# Altium project PROC054D_MMW_CAS_RF_EVM.PrjPcb (part 2 of 9)

## Sheet PROC054D_40MHZ_Clock.SchDoc: 40MHZ_CLOCK_1
size 558 x 431 mm; Date: Not shown in title block; ApprovedBy: Not shown in title block; CheckedBy: Not shown in title block; Author: Not shown in title block; CompanyName: Not shown in title block; DrawnBy: a0271760; Engineer: Not shown in title block; Organization: Not shown in title block; Address1: Not shown in title block; Address2: Not shown in title block; Address3: Not shown in title block; Address4: Not shown in title block; DocumentNumber: 13; Revision: Use project pAWRameter SCH_Rev; SheetNumber: 13; SheetTotal: 19; PageSetup: Record=PageOptions|CenterHorizontal=True|CenterVertical=True|PrintScale=1.00|XCorrection=1.00|YCorrection=1.00|PrintKind=0|BorderSize=5000000|LeftOffset=0|BottomOffset=0|Orientation=2|PaperLength=1000|PaperWidth=1000|Scale=100|PaperSource=15|PrintQuality=600|MediaType=1|DitherType=10|PaperKind=Letter|PrintScaleMode=1; CurrentTime: Not shown in title block; CurrentDate: Not shown in title block; Time: Not shown in title block; DocumentFullPathAndName: Not shown in title block; DocumentName: Not shown in title block; ModifiedDate: Not shown in title block; ImagePath: Not shown in title block
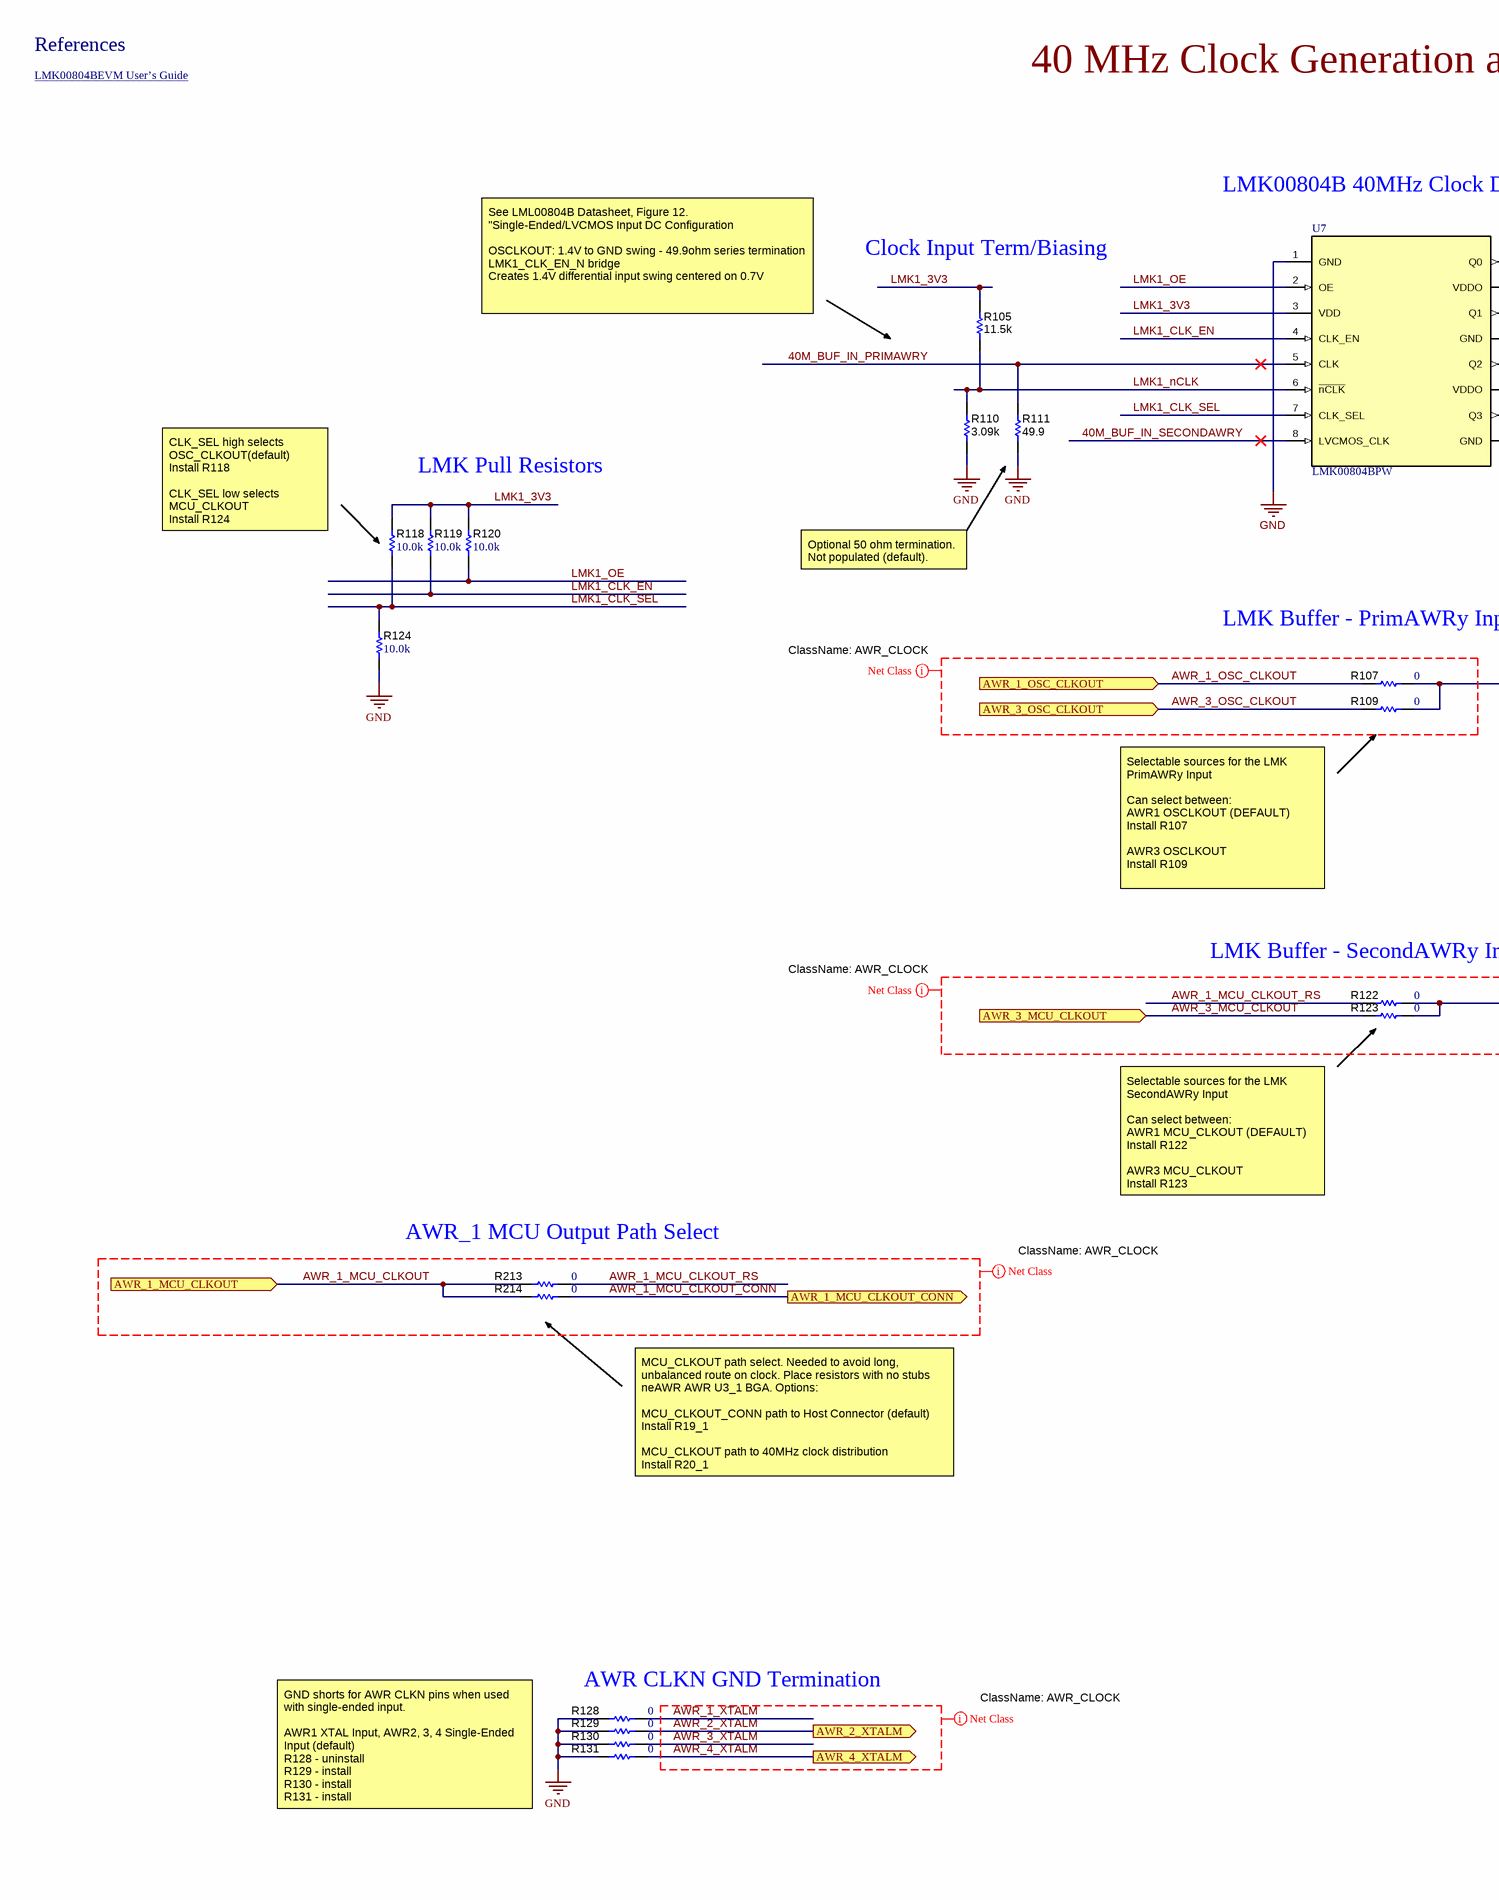
[diagram p8: PROC054D_40MHZ_Clock.SchDoc, left]
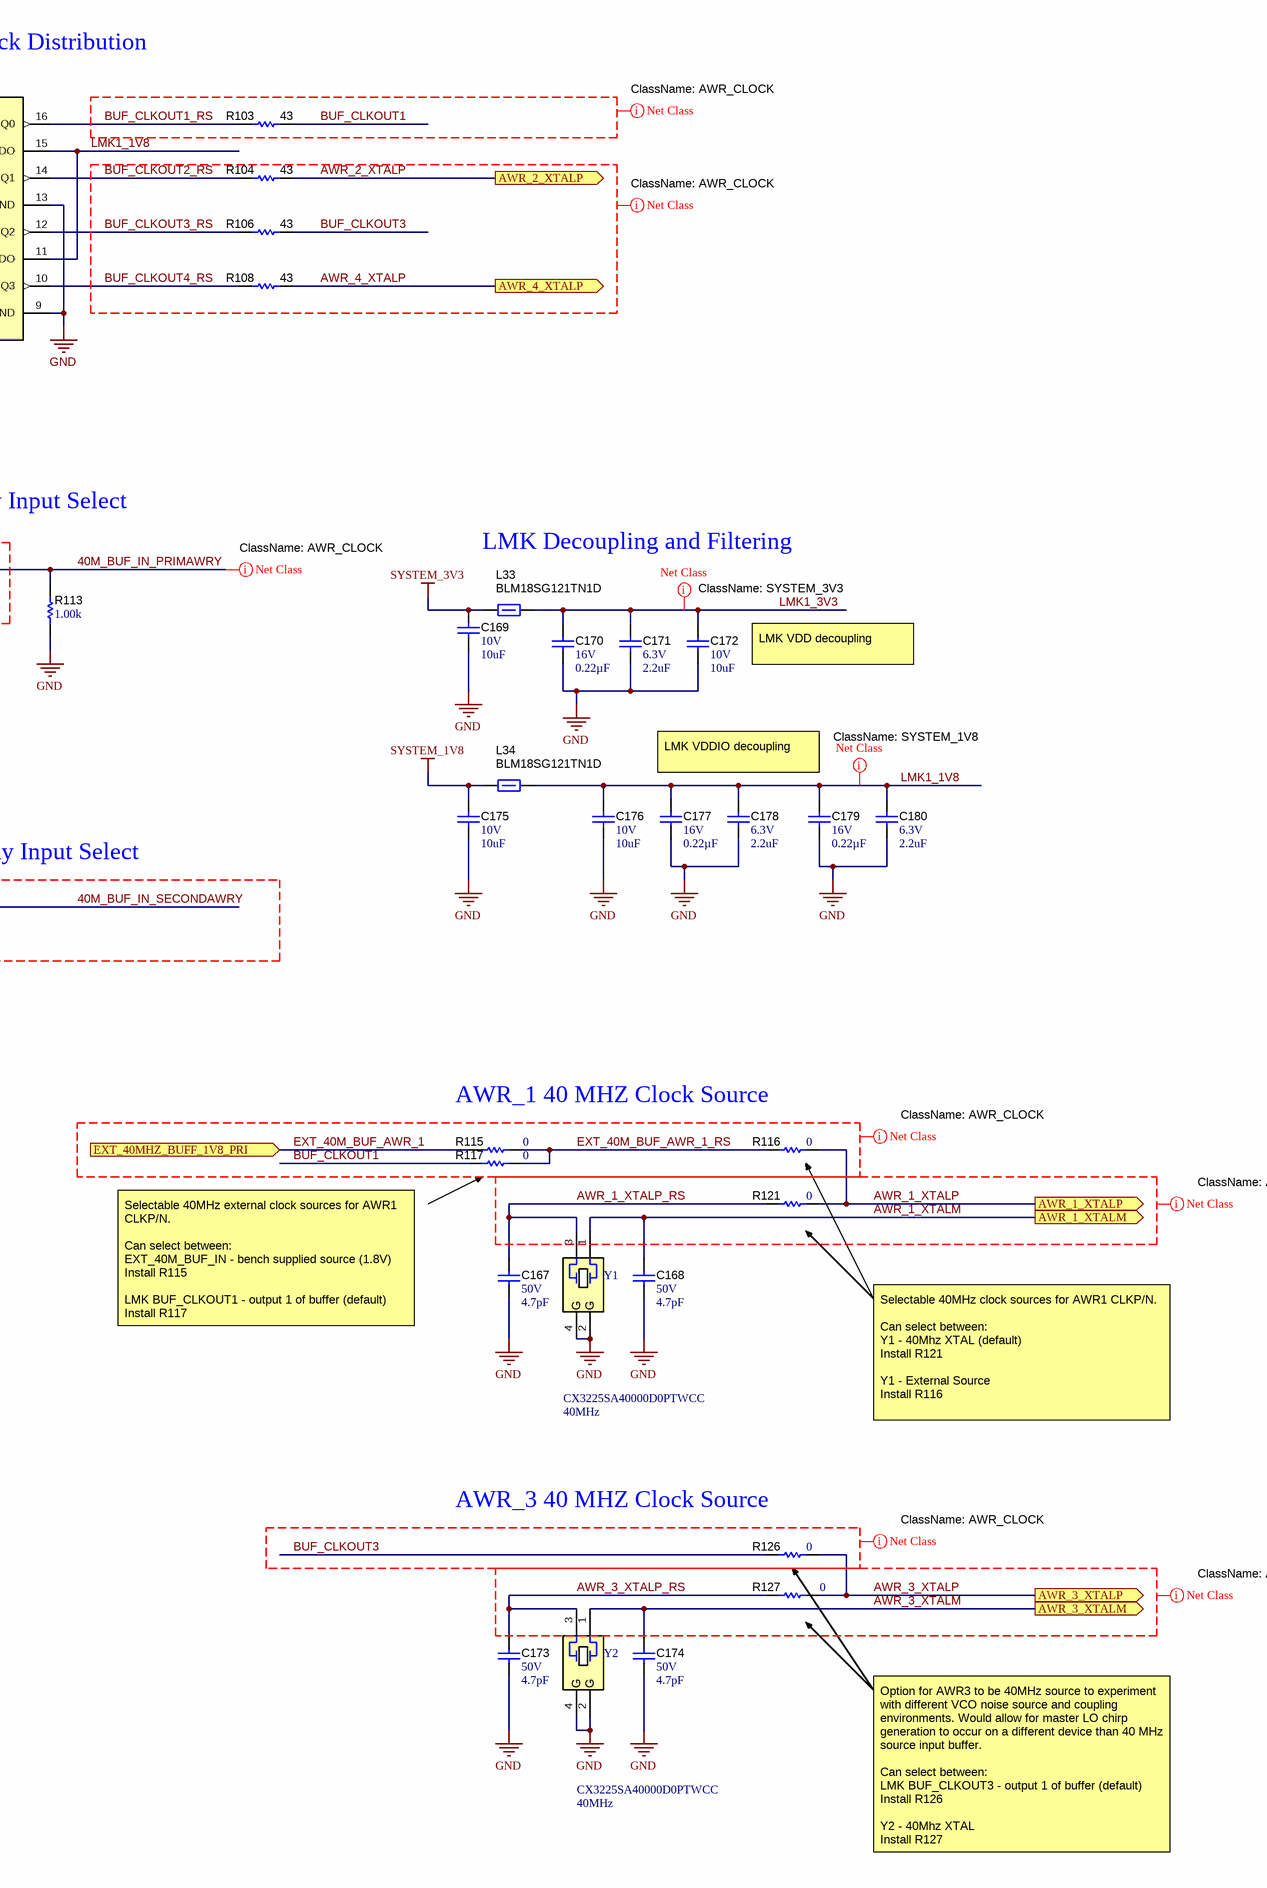
[diagram p9: PROC054D_40MHZ_Clock.SchDoc, right]

### Parts
C167  VDC_V: 50V  ValueDisplayed: 4.7pF  [0402]  (hidden comment: GJM1555C1H4R7BB01D)
C168  VDC_V: 50V  ValueDisplayed: 4.7pF  [0402]  (hidden comment: GJM1555C1H4R7BB01D)
C169  VDC_V: 10V  ValueDisplayed: 10uF  [0805_HV]  (hidden comment: GCM21BR71A106KE22L)
C170  VDC_V: 16V  ValueDisplayed: 0.22µF  [0402]  (hidden comment: GCM155R71C224KE02D)
C171  VDC_V: 6.3V  ValueDisplayed: 2.2uF  [0603]  (hidden comment: GCM188R70J225KE22D)
C172  VDC_V: 10V  ValueDisplayed: 10uF  [0805_HV]  (hidden comment: GCM21BR71A106KE22L)
C173  VDC_V: 50V  ValueDisplayed: 4.7pF  [0402]  (hidden comment: GJM1555C1H4R7BB01D)
C174  VDC_V: 50V  ValueDisplayed: 4.7pF  [0402]  (hidden comment: GJM1555C1H4R7BB01D)
C175  VDC_V: 10V  ValueDisplayed: 10uF  [0805_HV]  (hidden comment: GCM21BR71A106KE22L)
C176  VDC_V: 10V  ValueDisplayed: 10uF  [0805_HV]  (hidden comment: GCM21BR71A106KE22L)
C177  VDC_V: 16V  ValueDisplayed: 0.22µF  [0402]  (hidden comment: GCM155R71C224KE02D)
C178  VDC_V: 6.3V  ValueDisplayed: 2.2uF  [0603]  (hidden comment: GCM188R70J225KE22D)
C179  VDC_V: 16V  ValueDisplayed: 0.22µF  [0402]  (hidden comment: GCM155R71C224KE02D)
C180  VDC_V: 6.3V  ValueDisplayed: 2.2uF  [0603]  (hidden comment: GCM188R70J225KE22D)
L33  BLM18SG121TN1D  [0603]
L34  BLM18SG121TN1D  [0603]
R103  ValueDisplayed: 43  [0402]  (hidden comment: CRCW040243R0JNED)
R104  ValueDisplayed: 43  [0402]  (hidden comment: CRCW040243R0JNED)
R105  ValueDisplayed: 11.5k  [0402]  (hidden comment: ERJ-2RKF1152X)
R106  ValueDisplayed: 43  [0402]  (hidden comment: CRCW040243R0JNED)
R107  ValueDisplayed: 0  [0402]  (hidden comment: ERJ-2GE0R00X)
R108  ValueDisplayed: 43  [0402]  (hidden comment: CRCW040243R0JNED)
R109  ValueDisplayed: 0  [0402]  (hidden comment: ERJ-2GE0R00X)
R110  ValueDisplayed: 3.09k  [0402]  (hidden comment: ERJ-2RKF3091X)
R111  ValueDisplayed: 49.9  [0402]  (hidden comment: ERJ-2RKF49R9X)
R113  ValueDisplayed: 1.00k  [0402]  (hidden comment: CRCW04021K00FKED)
R115  ValueDisplayed: 0  [0402]  (hidden comment: ERJ-2GE0R00X)
R116  ValueDisplayed: 0  [0402]  (hidden comment: ERJ-2GE0R00X)
R117  ValueDisplayed: 0  [0402]  (hidden comment: ERJ-2GE0R00X)
R118  ValueDisplayed: 10.0k  [0402]  (hidden comment: CRCW040210K0FKED)
R119  ValueDisplayed: 10.0k  [0402]  (hidden comment: CRCW040210K0FKED)
R120  ValueDisplayed: 10.0k  [0402]  (hidden comment: CRCW040210K0FKED)
R121  ValueDisplayed: 0  [0402]  (hidden comment: ERJ-2GE0R00X)
R122  ValueDisplayed: 0  [0402]  (hidden comment: ERJ-2GE0R00X)
R123  ValueDisplayed: 0  [0402]  (hidden comment: ERJ-2GE0R00X)
R124  ValueDisplayed: 10.0k  [0402]  (hidden comment: CRCW040210K0FKED)
R126  ValueDisplayed: 0  [0402]  (hidden comment: ERJ-2GE0R00X)
R127  ValueDisplayed: 0  [0201]  (hidden comment: CRCW02010000Z0ED)
R128  ValueDisplayed: 0  [0402]  (hidden comment: ERJ-2GE0R00X)
R129  ValueDisplayed: 0  [0402]  (hidden comment: ERJ-2GE0R00X)
R130  ValueDisplayed: 0  [0402]  (hidden comment: ERJ-2GE0R00X)
R131  ValueDisplayed: 0  [0402]  (hidden comment: ERJ-2GE0R00X)
R213  ValueDisplayed: 0  [0402S]  (hidden comment: ERJ-2GE0R00X)
R214  ValueDisplayed: 0  [0402S]  (hidden comment: ERJ-2GE0R00X)
U7  LMK00804BPW  [PW0016A_N]
Y1  Frequency_Fixed: 40MHz  [Kyocera_CX3225SA]  (hidden comment: CX3225SA40000D0PTWCC)
Y2  Frequency_Fixed: 40MHz  [Kyocera_CX3225SA]  (hidden comment: CX3225SA40000D0PTWCC)

### Ports
AWR_1_MCU_CLKOUT (in), AWR_1_MCU_CLKOUT_CONN (out), AWR_1_OSC_CLKOUT (in), AWR_1_XTALM (out), AWR_1_XTALP (out), AWR_2_XTALM (out), AWR_2_XTALP (out), AWR_3_MCU_CLKOUT (in), AWR_3_OSC_CLKOUT (in), AWR_3_XTALM (out), AWR_3_XTALP (out), AWR_4_XTALM (out), AWR_4_XTALP (out), EXT_40MHZ_BUFF_1V8_PRI (in)

### Nets
GND: C167.2 C168.1 C169.2 C170.2 C171.1 C172.2 C173.2 C174.2 C175.2 C176.2 C177.2 C178.1 C179.2 C180.1 R110.1 R111.1 R113.1 R124.1 R128.2 R129.1 R130.1 R131.1 U7.1(GND) U7.9(GND) U7.13(GND) Y1.2(GND) Y1.4(GND) Y2.2(GND) Y2.4(GND)
SYSTEM_1V8: C175.1 L34.1
SYSTEM_3V3: C169.1 L33.1
40M_BUF_IN_PRIMAWRY: R107.2 R109.2 R111.2 R113.2 U7.5(CLK)
40M_BUF_IN_SECONDAWRY: R122.2 R123.2 U7.8(LVCMOS_CLK)
AWR_1_MCU_CLKOUT: R213.1 R214.1 ; port AWR_1_MCU_CLKOUT
AWR_1_MCU_CLKOUT_CONN: R214.2 ; port AWR_1_MCU_CLKOUT_CONN
AWR_1_MCU_CLKOUT_RS: R122.1 R213.2
AWR_1_OSC_CLKOUT: R107.1 ; port AWR_1_OSC_CLKOUT
AWR_1_XTALM: C168.2 R128.1 Y1.1 ; port AWR_1_XTALM
AWR_1_XTALP: R116.2 R121.2 ; port AWR_1_XTALP
AWR_1_XTALP_RS: C167.1 R121.1 Y1.3
AWR_2_XTALM: R129.2 ; port AWR_2_XTALM
AWR_2_XTALP: R104.2 ; port AWR_2_XTALP
AWR_3_MCU_CLKOUT: R123.1 ; port AWR_3_MCU_CLKOUT
AWR_3_OSC_CLKOUT: R109.1 ; port AWR_3_OSC_CLKOUT
AWR_3_XTALM: C174.1 R130.2 Y2.1 ; port AWR_3_XTALM
AWR_3_XTALP: R126.2 R127.2 ; port AWR_3_XTALP
AWR_3_XTALP_RS: C173.1 R127.1 Y2.3
AWR_4_XTALM: R131.2 ; port AWR_4_XTALM
AWR_4_XTALP: R108.2 ; port AWR_4_XTALP
BUF_CLKOUT1: R103.2 R117.1
BUF_CLKOUT1_RS: R103.1 U7.16(Q0)
BUF_CLKOUT2_RS: R104.1 U7.14(Q1)
BUF_CLKOUT3: R106.2 R126.1
BUF_CLKOUT3_RS: R106.1 U7.12(Q2)
BUF_CLKOUT4_RS: R108.1 U7.10(Q3)
EXT_40M_BUF_AWR_1: R115.1 ; port EXT_40MHZ_BUFF_1V8_PRI
EXT_40M_BUF_AWR_1_RS: R115.2 R116.1 R117.2
LMK1_1V8: C176.1 C177.1 C178.2 C179.1 C180.2 L34.2 U7.11(VDDO) U7.15(VDDO)
LMK1_3V3: C170.1 C171.2 C172.1 L33.2 R105.2 R118.2 R119.2 R120.2 U7.3(VDD)
LMK1_CLK_EN: R119.1 U7.4(CLK_EN)
LMK1_CLK_SEL: R118.1 R124.2 U7.7(CLK_SEL)
LMK1_nCLK: R105.1 R110.2 U7.6(~{nCLK})
LMK1_OE: R120.1 U7.2(OE)

### Layout directives
net class SYSTEM_3V3: LMK1_3V3
net class SYSTEM_1V8: LMK1_1V8
net class AWR_CLOCK: 40M_BUF_IN_PRIMAWRY, 40M_BUF_IN_SECONDAWRY, AWR_1_MCU_CLKOUT, AWR_1_MCU_CLKOUT_CONN, AWR_1_MCU_CLKOUT_RS, AWR_1_OSC_CLKOUT, AWR_1_XTALM, AWR_1_XTALP, AWR_1_XTALP_RS, AWR_2_XTALM, AWR_2_XTALP, AWR_3_MCU_CLKOUT, AWR_3_OSC_CLKOUT, AWR_3_XTALM, AWR_3_XTALP, AWR_3_XTALP_RS, AWR_4_XTALM, AWR_4_XTALP, BUF_CLKOUT1, BUF_CLKOUT1_RS, BUF_CLKOUT2_RS, BUF_CLKOUT3, BUF_CLKOUT3_RS, BUF_CLKOUT4_RS, EXT_40M_BUF_AWR_1, EXT_40M_BUF_AWR_1_RS

### Notes on the sheet
- References
- LMK00804BEVM User’s Guide <http://www.ti.com/lit/ug/snou129/snou129.pdf>
- 40 MHz Clock Generation and Distribution
- LMK00804B 40MHz Clock Distribution
- Clock Input Term/Biasing
- See LML00804B Datasheet, Figure 12. "Single-Ended/LVCMOS Input DC Configuration
  OSCLKOUT: 1.4V to GND swing - 49.9ohm series termination
  LMK1_CLK_EN_N bridge
  Creates 1.4V differential input swing centered on 0.7V
- LMK Pull Resistors
- CLK_SEL high selects
  OSC_CLKOUT(default)
  Install R118
  CLK_SEL low selects
  MCU_CLKOUT
  Install R124
- Optional 50 ohm termination.
  Not populated (default).
- LMK Buffer - PrimAWRy Input Select
- LMK Decoupling and Filtering
- LMK VDD decoupling
- Selectable sources for the LMK PrimAWRy Input
  Can select between:
  AWR1 OSCLKOUT (DEFAULT)
  Install R107
  AWR3 OSCLKOUT
  Install R109
- LMK VDDIO decoupling
- LMK Buffer - SecondAWRy Input Select
- Selectable sources for the LMK SecondAWRy Input
  Can select between:
  AWR1 MCU_CLKOUT (DEFAULT)
  Install R122
  AWR3 MCU_CLKOUT
  Install R123
- AWR_1 40 MHZ Clock Source
- AWR_1 MCU Output Path Select
- Selectable 40MHz external clock sources for AWR1 CLKP/N.
  Can select between:
  EXT_40M_BUF_IN - bench supplied source (1.8V)
  Install R115
  LMK BUF_CLKOUT1 - output 1 of buffer (default)
  Install R117
- MCU_CLKOUT path select. Needed to avoid long, unbalanced route on clock. Place resistors with no stubs neAWR AWR U3_1 BGA. Options:
  MCU_CLKOUT_CONN path to Host Connector (default)
  Install R19_1
  MCU_CLKOUT path to 40MHz clock distribution
  Install R20_1
- Selectable 40MHz clock sources for AWR1 CLKP/N.
  Can select between:
  Y1 - 40Mhz XTAL (default)
  Install R121
  Y1 - External Source
  Install R116
- (near R126) AWR_3 40 MHZ Clock Source
- AWR CLKN GND Termination
- GND shorts for AWR CLKN pins when used with single-ended input.
  AWR1 XTAL Input, AWR2, 3, 4 Single-Ended Input (default)
  R128 - uninstall
  R129 - install
  R130 - install
  R131 - install
- Option for AWR3 to be 40MHz source to experiment with different VCO noise source and coupling environments. Would allow for master LO chirp generation to occur on a different device than 40 MHz source input buffer.
  Can select between:
  LMK BUF_CLKOUT3 - output 1 of buffer (default)
  Install R126
  Y2 - 40Mhz XTAL
  Install R127
- Drawn By:
- SVN Rev:
- Number:
- TID #:
- Orderable:
- Rev:
- Sheet Title:
- File:
- Project Title:
- Designed for:
- Assembly VAWRiant:
- Mod. Date:
- Sheet:
- Size:
- of
- C
- http://www.ti.com
- Texas Instruments and/or its licensors do not wAWRrant the accuracy or completeness of this specification or any information contained therein. Texas Instruments and/or its licensors do not wAWRrant that this design will meet the specifications, will be suitable for your application or fit for any pAWRticulAWR purpose, or will operate in an implementation. Texas Instruments and/or its licensors do not wAWRrant that the design is production worthy. You should completely validate and test your design implementation to confirm the system functionality for your application.
- Engineer:
- Contact:
- © Texas Instruments
- (in symbol CMP-0004694-3) G

### Library data of the parts
C167 C168 C173 C174 = CMP-0006367-2: CAP, CERM, 4.7 pF, 50 V, +/- 2%, C0G/NP0, 0402; Manufacturer: MuRata; TaMin_C: -55°C; Polarized: N; SizeAreaWB_mm2: 3; Value1: Unknown; U/M: EA; Value: 4.7pF; TaMax_C: 125°C; SizeZ_mm: 0.6; SizeX_mm: 1; SizeY_mm: 0.5; AEC Category: Q200; Supplier Part Number 2: 81-GJM1555C1H4R7BB01; Publisher: Texas Instruments; Supplier 2: Mouser; TempCo: C0G/NP0; Published: 2008-06-19; RoHS: Y; MountType: SMT; Supplier 1: Digi-Key; PackageReference: 0402; Tolerance_%: 2%; Cap_Case: 0402; Value2: 50V; SizeArea_mm2: 0.5; CompType: Capacitor; LatestRevisionDate: 2017-03-09; PartNumber: GJM1555C1H4R7BB01D; AEC Qualified: N; Cap_F: 4.7pF; ComponentLink1Description: Datasheet link; AEC Grade: N/A; Supplier Part Number 1: 490-8102-1-ND; Technology: Ceramic; ComponentLink1URL: http://psearch.murata.com/capacitor/product/GJM1555C1H4R7BB01%23.pdf
C169 C172 C175 C176 = CMP-0008017-2: CAP, CERM, 10 uF, 10 V, +/- 10%, X7R, 0805; Manufacturer: MuRata; TaMin_C: -55°C; Polarized: N; SizeAreaWB_mm2: 6.75; Value1: Unknown; U/M: EA; Value: 10uF; TaMax_C: 125°C; SizeZ_mm: 1.45; SizeX_mm: 2; SizeY_mm: 1.25; Cap_Case: 0805; SizeArea_mm2: 2.5; CompType: Capacitor; Cap_F: 10µF; AEC Category: Q200; Supplier Part Number 2: 06AC6014; Publisher: Texas Instruments; Supplier 2: Newark; Supplier Part Number 3: 81-GCM21BR71A106KE2L; TempCo: X7R; Supplier 3: Mouser; Published: 2008-06-19; RoHS: Y; MountType: SMT; Supplier 1: Digi-Key; PackageReference: 0805; Tolerance_%: 10%; Value2: 10V; LatestRevisionDate: 2017-03-09; PartNumber: GCM21BR71A106KE22L; AEC Qualified: ?; ComponentLink1Description: Datasheet link; Supplier Part Number 1: 490-10674-1-ND; Technology: Ceramic; ComponentLink1URL: http://www.murata.com/products/catalog/pdf/c03e.pdf
C170 C177 C179 = CMP-0078265-1: CAP, CERM, 0.22 µF, 16 V,+/- 10%, X7R, AEC-Q200 Grade 1, 0402; Manufacturer: MuRata; TaMin_C: -55°C; Polarized: N; SizeAreaWB_mm2: 3; U/M: EA; Value: 0.22uF; TaMax_C: 125°C; SizeZ_mm: 0.6; SizeX_mm: 1; SizeY_mm: 0.5; CompType: Capacitor; AEC Qualified: Y; Cap_F: 220nF; AEC Category: Q200; ComponentLink1URL: http://psearch.en.murata.com/capacitor/product/GCM155R71C224KE02%23.pdf; Supplier Part Number 2: 81-GCM155R71C224KE2D; Supplier 2: Mouser; TempCo: X7R; RoHS: Y; MountType: SMT; Supplier 1: Digi-Key; PackageReference: 0402; Tolerance_%: 10%; Cap_Case: 0402; Value2: 16V; SizeArea_mm2: 0.5; PartNumber: GCM155R71C224KE02D; ComponentLink1Description: Datasheet link; AEC Grade: 1; Supplier Part Number 1: 490-10671-1-ND; Technology: Ceramic
C171 C178 C180 = CMP-0007134-5: CAP, CERM, 2.2 uF, 6.3 V, +/- 10%, X7R, AEC-Q200 Grade 1, 0603; Manufacturer: MuRata; TaMin_C: -55°C; Polarized: N; SizeAreaWB_mm2: 4.68; Value1: Unknown; U/M: EA; Value: 2.2uF; TaMax_C: 125°C; SizeZ_mm: 1; SizeX_mm: 1.6; SizeY_mm: 0.8; SizeArea_mm2: 1.28; AEC Qualified: Y; Cap_F: 2.2µF; AEC Category: Q200; Supplier Part Number 2: 81-GCM188R70J225KE2D; Publisher: Texas Instruments; Supplier 2: Mouser; TempCo: X7R; Published: 2008-06-19; RoHS: Y; MountType: SMT; Supplier 1: Digi-Key; PackageReference: 0603; Tolerance_%: 10%; Cap_Case: 0603; Value2: 6.3V; CompType: Capacitor; LatestRevisionDate: 2017-03-09; PartNumber: GCM188R70J225KE22D; ComponentLink1Description: Datasheet link; AEC Grade: 1; Supplier Part Number 1: 490-5316-1-ND; Technology: Ceramic; ComponentLink1URL: http://psearch.en.murata.com/capacitor/product/GCM188R70J225KE22%23.pdf
L33 L34 = CMP-0003352-2: Ferrite Bead, 120 ohm @ 100 MHz, 3 A, 0603; Manufacturer: MuRata; ZTyp@100MHz_Ohm: 120; SizeAreaWB_mm2: 4.68; DCR_ohm: 0.025; Value1: 0.025 ohm; Value: 120 ohm; Imax_A: 3A; SizeZ_mm: 1; SizeX_mm: 1.6; SizeY_mm: 0.8; SizeArea_mm2: 1.28; ComponentLink1URL: http://search.murata.co.jp/Ceramy/image/img/PDF/ENG/L0110S0100BLM18S.pdf; Supplier Part Number 2: 73M9122; Publisher: Texas Instruments; Supplier 2: Newark; Supplier Part Number 3: 81-BLM18SG121TN1D; Supplier 3: Mouser; Published: 2014-04-30; RoHS: Y; MountType: SMT; Supplier 1: Digi-Key; PackageReference: 0603; Value2: 3A; CompType: Ferrite Bead; LatestRevisionDate: 2017-03-09; PartNumber: BLM18SG121TN1D; ComponentLink1Description: Datasheet link; Supplier Part Number 1: 490-3996-1-ND; ValueDisplayed: 120 ohm
R103 R104 R106 R108 = CMP-0026932-3: RES, 43, 5%, 0.063 W, AEC-Q200 Grade 0, 0402; Manufacturer: Vishay-Dale; Power_W: 63mW; TempCo: 200 ppm/C; Value_Code: 43R0; Value: 43; EIA_Code: E24; SizeX_mm: 1; SizeY_mm: 0.5; SizeZ_mm: 0.6; Value2: 0.063W; AEC Qualified: Y; VDC_V: 50V; AEC Category: Q200; AEC Grade: 0; Supplier Part Number 2: 71-CRCW0402J-43-E3; Supplier 2: Mouser; RoHS: E; Value1: 5%; MountType: SMT; Supplier 1: Digi-Key; PackageReference: 0402; Tolerance_%: 5%; Res_ohm: 43; SizeArea_mm2: 0.5; CompType: Resistor; PartNumber: CRCW040243R0JNED; ComponentLink1Description: Datasheet link; Supplier Part Number 1: 541-43JCT-ND; Technology: Thick Film; ComponentLink1URL: http://www.vishay.com/docs/20035/dcrcwe3.pdf
R105 = CMP-0082348-1: RES, 11.5 k, 1%, 0.1 W, AEC-Q200 Grade 0, 0402; Manufacturer: Panasonic; Value_Code: 11k5; SizeAreaWB_mm2: 3; SizeArea_mm2: 0.5; AEC Qualified: Y; AEC Category: Q200; Value: 11.5k; SizeZ_mm: 0.6; EIA_Code: E96; TempCo: 100 ppm/C; AEC Grade: 0; Power_W: 100mW; Value2: 0.1W; SizeX_mm: 1; ComponentLink1Description: Datasheet link; RoHS: Y; Tolerance_%: 1%; PackageReference: 0402; Technology: Thick Film; Res_ohm: 11.5k; PartNumber: ERJ-2RKF1152X; SizeY_mm: 0.5; ComponentLink1URL: https://industrial.panasonic.com/cdbs/www-data/pdf/RDA0000/AOA0000C304.pdf; Value1: 1%; CompType: Resistor; MountType: SMT
R107 R109 R117 R122 R123 R129-R131 R213 R214 = CMP-0026992-3: RES, 0, 5%, 0.1 W, AEC-Q200 Grade 0, 0402; Manufacturer: Panasonic; Power_W: 100mW; TempCo: 600 ppm/C; Value_Code: 0000; Value: 0; EIA_Code: E24; SizeX_mm: 1; SizeY_mm: 0.5; SizeZ_mm: 0.6; Value2: 0.1W; AEC Qualified: Y; VDC_V: 50V; AEC Category: Q200; SizeAreaWB_mm2: 3; Supplier Part Number 2: 65T8307; Supplier 2: Newark; Supplier Part Number 3: 667-ERJ-2GE0R00X; Supplier 3: Mouser; RoHS: Y; Value1: 5%; MountType: SMT; Supplier 1: Digi-Key; PackageReference: 0402; Tolerance_%: 5%; Res_ohm: 0; SizeArea_mm2: 0.5; CompType: Resistor; PartNumber: ERJ-2GE0R00X; ComponentLink1Description: Datasheet link; Supplier Part Number 1: P0.0JCT-ND; Technology: Thick Film; ComponentLink1URL: https://industrial.panasonic.com/cdbs/www-data/pdf/RDA0000/AOA0000C301.pdf; AEC Grade: 0
R110 = CMP-0082349-1: RES, 3.09 k, 1%, 0.1 W, AEC-Q200 Grade 0, 0402; Manufacturer: Panasonic; Value_Code: 3k09; SizeAreaWB_mm2: 3; SizeArea_mm2: 0.5; AEC Qualified: Y; AEC Category: Q200; Value: 3.09k; SizeZ_mm: 0.6; Green_REACh: Incomplete; EIA_Code: E96; TempCo: 100 ppm/C; AEC Grade: 0; Power_W: 100mW; Value2: 0.1W; Green_Lifecycle: Active; SizeX_mm: 1; ComponentLink1Description: Datasheet link; RoHS: Y; Tolerance_%: 1%; Green_EU RoHS: Passed with Exemption; PackageReference: 0402; Technology: Thick Film; Res_ohm: 3.09k; PartNumber: ERJ-2RKF3091X; SizeY_mm: 0.5; ComponentLink1URL: https://industrial.panasonic.com/cdbs/www-data/pdf/RDA0000/AOA0000C304.pdf; Value1: 1%; CompType: Resistor; MountType: SMT; Green_EU RoHS-2: Incomplete
R111 = CMP-0026703-1: RES, 49.9, 1%, 0.1 W, AEC-Q200 Grade 0, 0402; Manufacturer: Panasonic; Power_W: 100mW; TempCo: 100 ppm/C; Value_Code: 49R9; U/M: EA; Value: 49.9; EIA_Code: E96; SizeX_mm: 1; SizeY_mm: 0.5; SizeZ_mm: 0.6; Value2: 0.1W; AEC Qualified: Y; VDC_V: 50V; AEC Grade: 0; AEC Category: Q200; ComponentLink1URL: http://industrial.panasonic.com/lecs/www-data/pdf/AOA0000/AOA0000CE2.pdf; Supplier Part Number 2: 73T6527; Publisher: Texas Instruments; Supplier 2: Newark; Supplier Part Number 3: 667-ERJ-2RKF49R9X; Supplier 3: Mouser; Published: 2008-06-26; RoHS: Y; Value1: 1%; MountType: SMT; Supplier 1: Digi-Key; PackageReference: 0402; Tolerance_%: 1%; Res_ohm: 49.9; SizeArea_mm2: 0.5; CompType: Resistor; LatestRevisionDate: 2017-03-09; PartNumber: ERJ-2RKF49R9X; ComponentLink1Description: Datasheet link; Supplier Part Number 1: P49.9LCT-ND; Technology: Thick Film
R113 = CMP-0026071-3: RES, 1.00 k, 1%, 0.063 W, AEC-Q200 Grade 0, 0402; Manufacturer: Vishay-Dale; Power_W: 63mW; TempCo: 100 ppm/C; Value_Code: 1k00; Value: 1.00k; EIA_Code: E96; Res_ohm: 1k; SizeX_mm: 1; SizeY_mm: 0.5; SizeZ_mm: 0.6; Value2: 0.063W; AEC Qualified: Y; VDC_V: 50V; AEC Category: Q200; AEC Grade: 0; Supplier Part Number 2: 52K6545; Supplier 2: Newark; Supplier Part Number 3: 71-CRCW0402-1.0K-E3; Supplier 3: Mouser; RoHS: E; Value1: 1%; MountType: SMT; Supplier 1: Digi-Key; PackageReference: 0402; Tolerance_%: 1%; SizeArea_mm2: 0.5; CompType: Resistor; PartNumber: CRCW04021K00FKED; ComponentLink1Description: Datasheet link; Supplier Part Number 1: 541-1.00KLCT-ND; Technology: Thick Film; ComponentLink1URL: http://www.vishay.com/docs/20035/dcrcwe3.pdf
R115 R116 R121 R126 R128 = CMP-0026992-3: RES, 0, 5%, 0.1 W, AEC-Q200 Grade 0, 0402; Manufacturer: Panasonic; Power_W: 100mW; TempCo: 600 ppm/C; Value_Code: 0000; Value: 0; EIA_Code: E24; SizeX_mm: 1; SizeY_mm: 0.5; SizeZ_mm: 0.6; Value2: 0.1W; CompType: Resistor; AEC Qualified: Y; VDC_V: 50V; AEC Category: Q200; SizeAreaWB_mm2: 3; Supplier Part Number 2: 65T8307; Supplier 2: Newark; Supplier Part Number 3: 667-ERJ-2GE0R00X; Supplier 3: Mouser; RoHS: Y; Value1: 5%; MountType: SMT; Supplier 1: Digi-Key; PackageReference: 0402; Tolerance_%: 5%; Res_ohm: 0; SizeArea_mm2: 0.5; PartNumber: ERJ-2GE0R00X; ComponentLink1Description: Datasheet link; Supplier Part Number 1: P0.0JCT-ND; Technology: Thick Film; ComponentLink1URL: https://industrial.panasonic.com/cdbs/www-data/pdf/RDA0000/AOA0000C301.pdf; AEC Grade: 0
R118-R120 R124 = CMP-0025958-3: RES, 10.0 k, 1%, 0.063 W, AEC-Q200 Grade 0, 0402; Manufacturer: Vishay-Dale; Power_W: 63mW; TempCo: 100 ppm/C; Value_Code: 10k0; Value: 10.0k; EIA_Code: E96; Res_ohm: 10k; SizeX_mm: 1; SizeY_mm: 0.5; SizeZ_mm: 0.6; Value2: 0.063W; AEC Qualified: Y; VDC_V: 50V; AEC Category: Q200; AEC Grade: 0; Supplier Part Number 2: 52K6595; Supplier 2: Newark; Supplier Part Number 3: 71-CRCW0402-10K-E3; Supplier 3: Mouser; RoHS: E; Value1: 1%; MountType: SMT; Supplier 1: Digi-Key; PackageReference: 0402; Tolerance_%: 1%; SizeArea_mm2: 0.5; CompType: Resistor; PartNumber: CRCW040210K0FKED; ComponentLink1Description: Datasheet link; Supplier Part Number 1: 541-10.0KLCT-ND; Technology: Thick Film; ComponentLink1URL: http://www.vishay.com/docs/20035/dcrcwe3.pdf
R127 = CMP-0027008-4: RES, 0, 5%, 0.05 W, 0201; Manufacturer: Vishay-Dale; Power_W: 50mW; TempCo: ppm/C; Value_Code: 0000; Value: 0; EIA_Code: E24; SizeX_mm: 0.6; SizeY_mm: 0.3; SizeZ_mm: 0.26; Value2: 0.05W; SizeArea_mm2: 0.18; AEC Qualified: N; AEC Category: Q200; RoHS: E; Value1: 5%; MountType: SMT; Supplier 1: Newark; PackageReference: 0201; Tolerance_%: 5%; Res_ohm: 0; CompType: Resistor; PartNumber: CRCW02010000Z0ED; ComponentLink1Description: Datasheet link; AEC Grade: N/A; Supplier Part Number 1: 72M6743; Technology: Thick Film; ComponentLink1URL: http://www.vishay.com/docs/20052/crcw0201e3.pdf
U7 = CMP-0065663-1: Low Skew, 1-to-4 Multiplexed Differential/LVCMOS-to-LVCMOS/TTL Fanout Buffer, PW0016A (TSSOP-16); Alternate Manufacturer: Texas Instruments; Green_Lifecycle: Active; SizeAreaWB_mm2: 58.8; Green_REACh: Passed; U/M: EA; SizeZ_mm: 1.2; SizeX_mm: 6.4; SizeY_mm: 5.0; SizeArea_mm2: 32.0; CompType: IC; ComponentLink1URL: http://www.ti.com/lit/ds/symlink/lmk00804b.pdf; Publisher: Texas Instruments; PackageDescription: TSSOP-16; RoHS: Y; Footprint Path 6: C:\AltiumLibraries\Footprints\TI\.PcbLib; MountType: SMT; Green_EU RoHS-2: Passed; Manufacturer: Texas Instruments; Green_EU RoHS: Passed; PackageReference: PW0016A; LatestRevisionDate: 2017-06-09; PartNumber: LMK00804BPW; ComponentLink1Description: Datasheet Link
Y1 Y2 = CMP-0004694-3: Crystal, 40 MHz, 8pF, SMD; Manufacturer: Kyocera; TaMin_C: -40°C; Frequency Stability: +/-200ppm; SizeAreaWB_mm2: 14.7; TaMax_C: 125°C; SizeZ_mm: 0.8; SizeX_mm: 2.5; SizeY_mm: 3.2; SizeArea_mm2: 8; RoHS: Y; MountType: SMT; Supplier 1: Mouser; PackageReference: 3.2x2.5mm; CompType: Crystal; PartNumber: CX3225SA40000D0PTWCC; ComponentLink1Description: Datasheet Link; Supplier Part Number 1: 581-CX3225SA40D0PTWC; ComponentLink1URL: http://www.kyocera-crystal.jp/eng/wp-content/uploads/2016/10/cx3225sa_e.pdf